# Altium schematic sheet [0]_Block_Diagram.SchDoc
size A4; Author: Tomislav Ivaniš; Engineer: Tomislav Ivaniš
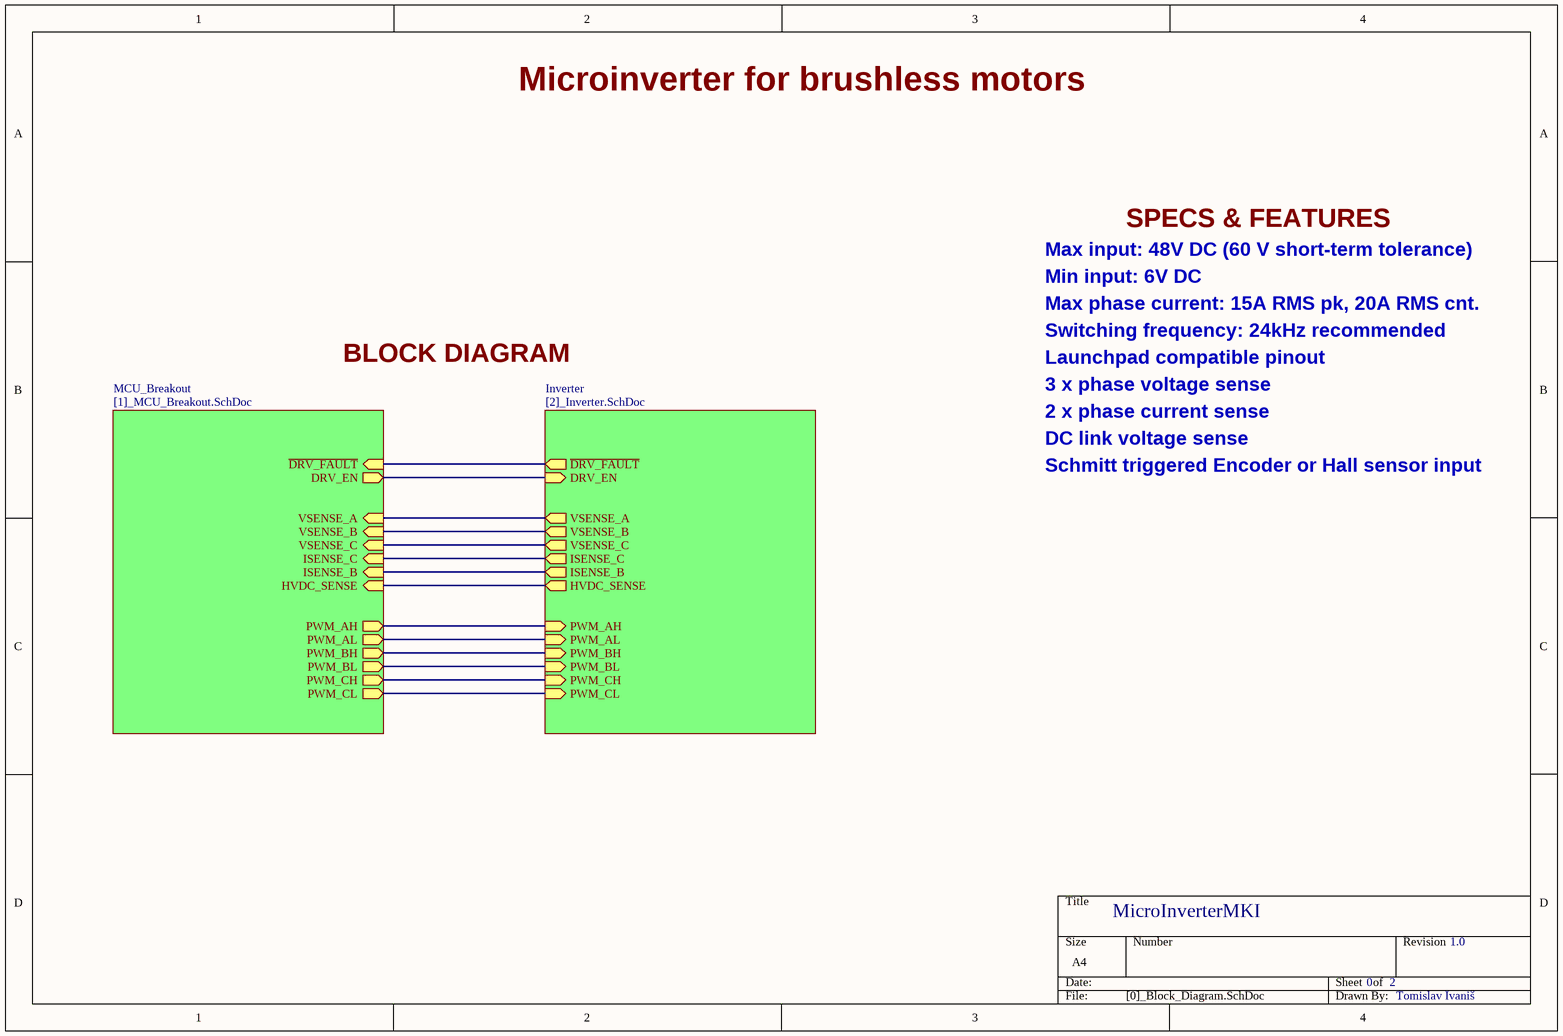
[diagram p0: [0]_Block_Diagram.SchDoc]

## Sub-sheets
Inverter = [2]_Inverter.SchDoc: ~{DRV_FAULT} (out), DRV_EN (in), VSENSE_A (out), VSENSE_B (out), VSENSE_C (out), ISENSE_C (out), ISENSE_B (out), HVDC_SENSE (out), PWM_AH (in), PWM_AL (in), PWM_BH (in), PWM_BL (in), PWM_CH (in), PWM_CL (in)
MCU_Breakout = [1]_MCU_Breakout.SchDoc: ~{DRV_FAULT} (in), DRV_EN (out), VSENSE_A (in), VSENSE_B (in), VSENSE_C (in), ISENSE_C (in), ISENSE_B (in), HVDC_SENSE (in), PWM_AH (out), PWM_AL (out), PWM_BH (out), PWM_BL (out), PWM_CH (out), PWM_CL (out)

## Nets
(unnamed): sheet MCU_Breakout/~{DRV_FAULT}, sheet Inverter/~{DRV_FAULT}
(unnamed): sheet MCU_Breakout/DRV_EN, sheet Inverter/DRV_EN
(unnamed): sheet MCU_Breakout/VSENSE_A, sheet Inverter/VSENSE_A
(unnamed): sheet MCU_Breakout/VSENSE_B, sheet Inverter/VSENSE_B
(unnamed): sheet MCU_Breakout/VSENSE_C, sheet Inverter/VSENSE_C
(unnamed): sheet MCU_Breakout/ISENSE_C, sheet Inverter/ISENSE_C
(unnamed): sheet MCU_Breakout/ISENSE_B, sheet Inverter/ISENSE_B
(unnamed): sheet MCU_Breakout/HVDC_SENSE, sheet Inverter/HVDC_SENSE
(unnamed): sheet MCU_Breakout/PWM_AH, sheet Inverter/PWM_AH
(unnamed): sheet MCU_Breakout/PWM_AL, sheet Inverter/PWM_AL
(unnamed): sheet MCU_Breakout/PWM_BH, sheet Inverter/PWM_BH
(unnamed): sheet MCU_Breakout/PWM_BL, sheet Inverter/PWM_BL
(unnamed): sheet MCU_Breakout/PWM_CH, sheet Inverter/PWM_CH
(unnamed): sheet MCU_Breakout/PWM_CL, sheet Inverter/PWM_CL

## Notes on the sheet
- Microinverter for brushless motors
- SPECS & FEATURES
- Max input: 48V DC (60 V short-term tolerance)
- Max phase current: 15A RMS pk, 20A RMS cnt.
- Min input: 6V DC
- BLOCK DIAGRAM
- Launchpad compatible pinout
- Switching frequency: 24kHz recommended
- 3 x phase voltage sense
- 2 x phase current sense
- DC link voltage sense
- Schmitt triggered Encoder or Hall sensor input
- MicroInverterMKI
- 0
- 2
- 1.0